# Altium schematic sheet ESP01_Relay.SchDoc
size A4; SheetNumber: 1; SheetTotal: 1
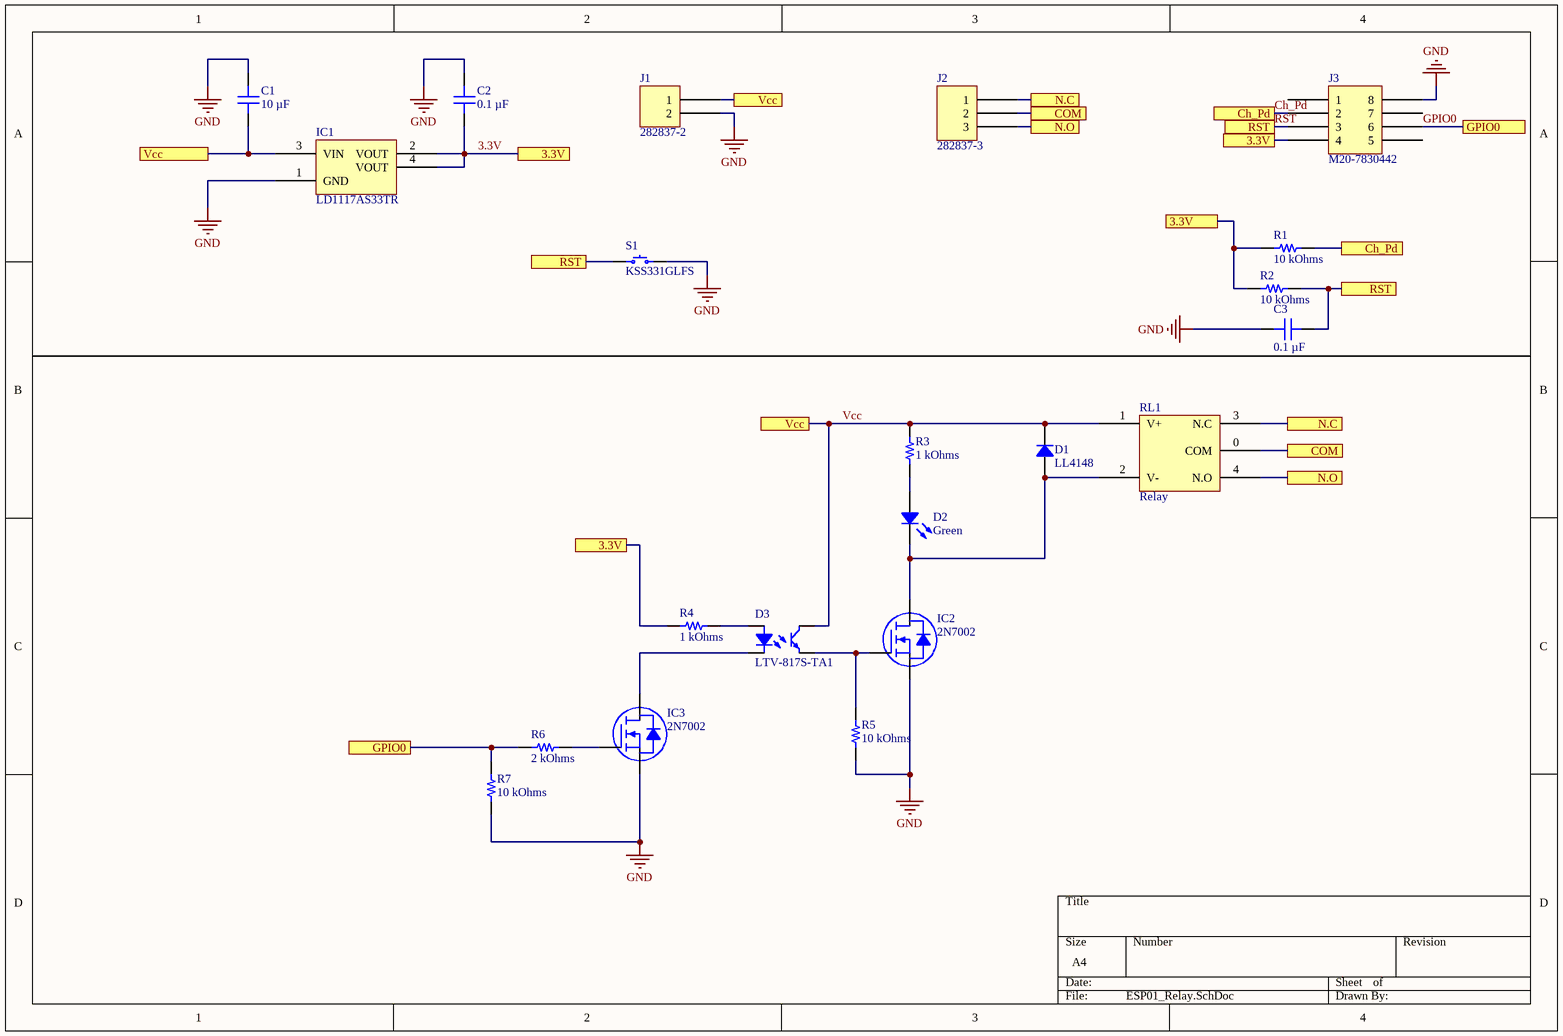
[diagram p0: ESP01_Relay.SchDoc]

## Parts
C1  10 µF  [CAP 1206_3216 - 0.8MM]
C2  0.1 µF  [CAP 1206_3216 - 0.8MM]
C3  0.1 µF  [CAP 0805_2012]
D1  LL4148  [SOD-80 MiniMELF]
D2  Green  [LED 1206_3216 GREEN]
D3  LTV-817S-TA1  [LITEON LTV-817]
IC1  LD1117AS33TR  [ST SOT-223]
IC2  2N7002  [ON SEMI SOT-23-3]
IC3  2N7002  [ON SEMI SOT-23-3]
J1  282837-2  [TE 282837-2]
J2  282837-3  [TE 282837-3]
J3  M20-7830442  [HARWIN M20-7830445]
R1  10 kOhms  [RES 1206_3216]
R2  10 kOhms  [RES 1206_3216]
R3  1 kOhms  [RES 1206_3216]
R4  1 kOhms  [RES 1206_3216]
R5  10 kOhms  [RES 1206_3216]
R6  2 kOhms  [RES 1206_3216]
R7  10 kOhms  [RES 1206_3216]
RL1  Relay  [Relay]
S1  KSS331GLFS  [C&K KSS]

## Ports
3.3V (see ESP01_Relay[2A], ESP01_Relay[2C], ESP01_Relay[3A]), 3.3V (see ESP01_Relay[2A], ESP01_Relay[2C], ESP01_Relay[4A]), 3.3V (see ESP01_Relay[2A], ESP01_Relay[3A], ESP01_Relay[4A]), 3.3V (see ESP01_Relay[2C], ESP01_Relay[3A], ESP01_Relay[4A]), Ch_Pd (see ESP01_Relay[4A]), COM (see ESP01_Relay[3A]), COM (see ESP01_Relay[4B]), GPIO0 (see ESP01_Relay[1C]), GPIO0 (see ESP01_Relay[4A]), N.C (see ESP01_Relay[3A]), N.C (see ESP01_Relay[4B]), N.O (see ESP01_Relay[3A]), N.O (see ESP01_Relay[4B]), RST (see ESP01_Relay[2B], ESP01_Relay[4A]), RST (see ESP01_Relay[2B], ESP01_Relay[4B]), RST (see ESP01_Relay[4A], ESP01_Relay[4B]), Vcc (see ESP01_Relay[1A], ESP01_Relay[2A]), Vcc (see ESP01_Relay[1A], ESP01_Relay[2B]), Vcc (see ESP01_Relay[2A], ESP01_Relay[2B])

## Nets
GND: C1.1 C2.1 C3.1 IC1.1(GND) IC2.2(S) IC3.2(S) J1.2 J3.8 R5.1 R7.1 S1.2
3.3V: C2.2 IC1.2(VOUT) IC1.4(VOUT) J3.4 R1.1 R2.1 R4.2 ; port 3.3V
Ch_Pd: J3.2 R1.2 ; port Ch_Pd
COM: J2.2 RL1.0(COM) ; port COM
GPIO0: J3.6 R6.1 R7.2 ; port GPIO0
N.C: J2.1 RL1.3(N.C) ; port N.C
N.O: J2.3 RL1.4(N.O) ; port N.O
RST: C3.2 J3.3 R2.2 S1.1 ; port RST
Vcc: C1.2 D1.2 D3.4 IC1.3(VIN) J1.1 R3.2 RL1.1(V+) ; port Vcc
NetD1_1: D1.1 D2.2 IC2.3(D) RL1.2(V-)
NetD2_1: D2.1 R3.1
NetD3_1: D3.1 R4.1
NetD3_2: D3.2 IC3.3(D)
NetD3_3: D3.3 IC2.1(G) R5.2
NetIC3_1: IC3.1(G) R6.2

Not connected (* = marked no-connect by the designer): J3 1 5 7

## Library data of the parts
C1 = 1206B106K160CT: CAP CER 10UF 16V X7R 1206; manufacturer: Walsin Technology Corporation; Tolerance: ±10%; Part Number: 1206B106K160CT; Value: 10 µF; Applications: General Purpose; Capacitance: 10 µF; componentlink1description: Datasheet; componentlink1url: https://www.passivecomponent.com/wp-content/uploads/datasheet/WTC_MLCC_General_Purpose.pdf; componentlink2description: DigiKey Link; componentlink2url: https://www.digikey.com/en/products/detail/walsin-technology-corporation/1206B106K160CT/6707562; Device Package: 1206 (3216 Metric); lastupdated: 23.10.2023 19:16:40; Lifecycle Status: Active; Minimum Order: 2000; Mounting Type: Surface Mount, MLCC; Operating Temperature: -55°C ~ 125°C; Package / Case: 1206 (3216 Metric); packaging: TapeAndReel; partid: 49918; Part Status: Active; price: 0.20; series: -; Size / Dimension: 0.126" L x 0.063" W (3.20mm x 1.60mm); Supplier 1: DigiKey; Supplier Part Number 1: 1206B106K160CT-ND; Temperature Coefficient: X7R; Thickness (Max): 0.075" (1.90mm); Voltage - Rated: 16V
C2 = 1206B104J500CT: CAP CER 0.1UF 50V X7R 1206; manufacturer: Walsin Technology Corporation; Tolerance: ±5%; Part Number: 1206B104J500CT; Value: 0.1 µF; Applications: General Purpose; Capacitance: 0.1 µF; componentlink1description: Datasheet; componentlink1url: http://www.passivecomponent.com/wp-content/uploads/2018/10/MLCC.pdf; componentlink2description: DigiKey Link; componentlink2url: https://www.digikey.com/en/products/detail/walsin-technology-corporation/1206B104J500CT/9355099; Device Package: 1206 (3216 Metric); lastupdated: 23.10.2023 19:17:26; Lifecycle Status: Active; Minimum Order: 1; Mounting Type: Surface Mount, MLCC; Operating Temperature: -55°C ~ 125°C; Package / Case: 1206 (3216 Metric); packaging: TapeAndReel; partid: 19711; Part Status: Active; price: 0.02; series: -; Size / Dimension: 0.126" L x 0.063" W (3.20mm x 1.60mm); Supplier 1: DigiKey; Supplier Part Number 1: 1292-1602-1-ND; Temperature Coefficient: X7R; Thickness (Max): 0.035" (0.90mm); Voltage - Rated: 50V
C3 = CC0805MRX7R9BB104: CAP CER 0.1UF 50V X7R 0805; manufacturer: Yageo; Tolerance: ±20%; Part Number: CC0805MRX7R9BB104; Value: 0.1 µF; Applications: General Purpose; Capacitance: 0.1 µF; componentlink1description: Datasheet; componentlink1url: https://www.yageo.com/upload/media/product/productsearch/datasheet/mlcc/UPY-GPHC_X7R_6.3V-to-50V_18.pdf; componentlink2description: DigiKey Link; componentlink2url: https://www.digikey.com/en/products/detail/yageo/CC0805MRX7R9BB104/5884281; Device Package: 0805 (2012 Metric); lastupdated: 24.10.2023 19:16:25; Lifecycle Status: Active; Minimum Order: 1; Mounting Type: Surface Mount, MLCC; Operating Temperature: -55°C ~ 125°C; Package / Case: 0805 (2012 Metric); packaging: TapeAndReel; partid: 2475; Part Status: Active; price: 0.01; series: CC; Size / Dimension: 0.079" L x 0.049" W (2.00mm x 1.25mm); Supplier 1: DigiKey; Supplier Part Number 1: 311-4351-1-ND; Temperature Coefficient: X7R; Thickness (Max): 0.037" (0.95mm); Voltage - Rated: 50V
D1 = LL4148: DIODE GEN PURP 100V 200MA SOD80; Manufacturer: ON Semiconductor; Current - Reverse Leakage @ Vr: 25nA @ 20V; Diode Type: Standard; Reverse Recovery Time (trr): 4ns; Speed: Small Signal =< 200mA (Io), Any Speed; Voltage - Forward (Vf) (Max) @ If: 1V @ 10mA; Part Number: LL4148; ComponentLink1Description: Datasheet; ComponentLink1URL: https://www.onsemi.com/pub/Collateral/LL4148-D.pdf; ComponentLink2Description: DigiKey Link; ComponentLink2URL: http://digikey.com/product-detail/en/on-semiconductor/LL4148/LL4148FSCT-ND/1923118; Current - Average Rectified (Io): 200mA; LastUpdated: 23.10.2023 20:25:50; Lifecycle Status: Active; Minimum Order: 1; Mounting Type: Surface Mount; Operating Temperature - Junction: -55°C ~ 175°C; Package / Case: DO-213AC, MINI-MELF, SOD-80; Packaging: TapeAndReel; PartId: 2621; Part Status: Active; Price: 0.02; Series: -; Supplier 1: DigiKey; Supplier Part Number 1: LL4148FSCT-ND; Supplier Device Package: SOD-80; Voltage - DC Reverse (Vr) (Max): 100V
D2 = XZVG55W-A2: LED GREEN CLEAR 2SMD; Manufacturer: SunLED; Configuration: Standard; Current - Test: 20mA; Lens Color: Colorless; Lens Size: 1.60mm Dia; Lens Style: Round with Flat Top; Millicandela Rating: 98mcd; Viewing Angle: 70°; Voltage - Forward (Vf) (Typ): 2.1V; Wavelength - Dominant: 570nm; Wavelength - Peak: 574nm; Part Number: XZVG55W-A2; Color: Green; ComponentLink1Description: Datasheet; ComponentLink1URL: https://www.sunledusa.com/products/spec/XZVG55W-A2.pdf; ComponentLink2Description: DigiKey Link; ComponentLink2URL: https://www.digikey.com/en/products/detail/sunled/XZVG55W-A2/4902120; Device Package: 1206 (3216 Metric); Height (Max): 1.10mm; LastUpdated: 23.10.2023 20:20:25; Lens Transparency: Clear; Lifecycle Status: Active; Minimum Order: 1; Mounting Type: Surface Mount; Package / Case: 1206 (3216 Metric); Packaging: TapeAndReel; PartId: 523; Part Status: Active; Price: 0.07; Series: -; Size / Dimension: 3.20mm L x 1.60mm W; Supplier 1: DigiKey; Supplier Part Number 1: 1497-1403-1-ND; Supplier Device Package: 2-SMD; Value: Green
D3 = LTV-817S-TA1: OPTOISOLATR 5KV TRANSISTOR 4-SMD; Manufacturer: Lite-On Inc.; Current - DC Forward (If) (Max): 50mA; Current Transfer Ratio (Max): 600% @ 5mA; Current Transfer Ratio (Min): 50% @ 5mA; Input Type: DC; Number of Channels: 1; Rise / Fall Time (Typ): 4µs, 3µs; Vce Saturation (Max): 200mV; Voltage - Forward (Vf) (Typ): 1.2V; Voltage - Isolation: 5000Vrms; Voltage - Output (Max): 35V; Part Number: LTV-817S-TA1; ComponentLink1Description: Datasheet; ComponentLink1URL: http://optoelectronics.liteon.com/upload/download/DS-70-96-0016/LTV-8X7%20series%20201610%20.pdf; ComponentLink2Description: DigiKey Link; ComponentLink2URL: http://digikey.com/product-detail/en/lite-on-inc/LTV-817S-TA1/160-1893-1-ND/3306757; Current - Output / Channel: 50mA; Device Package: 4-SMD, Gull Wing; LastUpdated: 12.01.2020 21:58:48; Lifecycle Status: Active; Minimum Order: 1; Mounting Type: Surface Mount; Operating Temperature: -30°C ~ 110°C; Output Type: Transistor; Package / Case: 4-SMD, Gull Wing; Packaging: TapeAndReel; Part Status: Active; Price: 0.12; Series: -; Supplier 1: DigiKey; Supplier Part Number 1: 160-1893-1-ND; Supplier Device Package: 4-SMD
IC1 = LD1117AS33TR: IC REG LINEAR 3.3V 1A SOT223; Manufacturer: STMicroelectronics; Current - Quiescent (Iq): 10 mA; Number of Regulators: 1; Output Configuration: Positive; Output Type: Fixed; Protection Features: Over Current, Over Temperature; PSRR: 75dB (120Hz); Voltage Dropout (Max): 1.3V @ 1A; Voltage - Input (Max): 15V; Part Number: LD1117AS33TR; ComponentLink1Description: Datasheet; ComponentLink1URL: http://www.st.com/content/ccc/resource/technical/document/datasheet/a5/c3/3f/c9/2b/15/40/49/CD00002116.pdf/files/CD00002116.pdf/jcr:content/translations/en.CD00002116.pdf; ComponentLink2Description: DigiKey Link; ComponentLink2URL: https://www.digikey.com/en/products/detail/stmicroelectronics/LD1117AS33TR/585752; Current - Output: 1A; LastUpdated: 23.10.2023 20:33:15; Lifecycle Status: Active; Minimum Order: 1; Mounting Type: Surface Mount; Operating Temperature: 0°C ~ 125°C; Package / Case: TO-261-4, TO-261AA; Packaging: TapeAndReel; Part Status: Active; Price: 0.37; Series: -; Supplier 1: DigiKey; Supplier Part Number 1: 497-1228-1-ND; Supplier Device Package: SOT-223; Voltage - Output (Min/Fixed): 3.3V
IC2 IC3 = 2N7002: MOSFET N-CH 60V 115MA SOT-23; Manufacturer: ON Semiconductor; Current - Continuous Drain (Id) @ 25°C: 115mA (Ta); Drive Voltage (Max Rds On,  Min Rds On): 5V, 10V; FET Type: N-Channel; Input Capacitance (Ciss) (Max) @ Vds: 50pF @ 25V; Power Dissipation (Max): 200mW (Ta); Rds On (Max) @ Id, Vgs: 7.5Ohm @ 500mA, 10V; Vgs (Max): ±20V; Vgs(th) (Max) @ Id: 2.5V @ 250µA; Part Number: 2N7002; ComponentLink1Description: Datasheet; ComponentLink1URL: https://www.onsemi.com/pub/Collateral/NDS7002A-D.PDF; ComponentLink2Description: DigiKey Link; ComponentLink2URL: http://digikey.com/product-detail/en/on-semiconductor/2N7002/2N7002NCT-ND/244664; Drain to Source Voltage (Vdss): 60V; LastUpdated: 23.10.2023 20:34:06; Lifecycle Status: Active; Minimum Order: 1; Mounting Type: Surface Mount; Operating Temperature: -55°C ~ 150°C (TJ); Package / Case: TO-236-3, SC-59, SOT-23-3; Packaging: TapeAndReel; Part Status: Active; Price: 0.06; Series: -; Supplier 1: DigiKey; Supplier Part Number 1: 2N7002NCT-ND; Supplier Device Package: SOT-23 (TO-236AB); Technology: MOSFET (Metal Oxide)
J1 = 282837-2: TERM BLK 2P SIDE ENT 5.08MM PCB; Manufacturer: TE Connectivity AMP Connectors; Current: 13.5 A; Mating Orientation: Horizontal with Board; Number of Levels: 1; Pitch: 0.200" (5.08mm); Positions Per Level: 2; Voltage: 300 V; Wire Gauge: 16-28 AWG; Wire Termination: Screw - Rising Cage Clamp; Part Number: 282837-2; Color: Green; ComponentLink1Description: Datasheet; ComponentLink1URL: https://www.te.com/commerce/DocumentDelivery/DDEController?Action=srchrtrv&DocNm=282837&DocType=Customer+Drawing&DocLang=English; ComponentLink2Description: DigiKey Link; ComponentLink2URL: https://www.digikey.com/en/products/detail/te-connectivity-amp-connectors/282837-2/2187973; Features: Interlocking (Side); LastUpdated: 21.06.2022 15:00:23; Lifecycle Status: Active; Minimum Order: 1; Mounting Type: Through Hole; Packaging: Tray; Part Status: Active; Price: 0.31; Series: Buchanan; Supplier 1: DigiKey; Supplier Part Number 1: A113320-ND
J2 = 282837-3: TERM BLK 3P SIDE ENT 5.08MM PCB; Manufacturer: TE Connectivity AMP Connectors; Current: 13.5 A; Mating Orientation: Horizontal with Board; Number of Levels: 1; Pitch: 0.200" (5.08mm); Positions Per Level: 3; Voltage: 300 V; Wire Gauge: 16-28 AWG; Wire Termination: Screw - Rising Cage Clamp; Part Number: 282837-3; Color: Green; ComponentLink1Description: Datasheet; ComponentLink1URL: https://www.te.com/commerce/DocumentDelivery/DDEController?Action=srchrtrv&DocNm=282837&DocType=Customer+Drawing&DocLang=English; ComponentLink2Description: DigiKey Link; ComponentLink2URL: https://www.digikey.com/en/products/detail/te-connectivity-amp-connectors/282837-3/2187974; Features: Interlocking (Side); LastUpdated: 21.06.2022 15:00:39; Lifecycle Status: Active; Minimum Order: 1; Mounting Type: Through Hole; Packaging: Tray; Part Status: Active; Price: 0.47; Series: Buchanan; Supplier 1: DigiKey; Supplier Part Number 1: A113321-ND
J3 = M20-7830442: CONN RCPT 8POS 0.1 GOLD PCB; Manufacturer: Harwin Inc.; Connector Type: Receptacle; Contact Length - Post: 0.118" (3.00mm); Current Rating (Amps): 3A; Mated Stacking Heights: 11.04mm, 12.63mm; Material Flammability Rating: UL94 V-0; Number of Positions: 8; Number of Positions Loaded: All; Pitch - Mating: 0.100" (2.54mm); Style: Board to Board or Cable; Part Number: M20-7830442; ComponentLink1Description: Datasheet; ComponentLink1URL: https://cdn.harwin.com/pdfs/C001XX_M20_Series_Connectors.pdf; ComponentLink2Description: DigiKey Link; ComponentLink2URL: http://digikey.com/product-detail/en/harwin-inc/M20-7830442/952-1789-ND/3727758; Contact Finish - Mating: Gold; Contact Finish - Post: Tin; Contact Finish Thickness - Mating: Flash; Contact Type: Female Socket; Fastening Type: Push-Pull; Insulation Color: Black; Insulation Height: 0.335" (8.51mm); LastUpdated: 21.09.2022 19:04:26; Lifecycle Status: Active; Minimum Order: 1; Mounting Type: Through Hole; Number of Rows: 2; Operating Temperature: -40°C ~ 105°C; Packaging: Tube; Part Status: Active; Price: 1.36; Row Spacing - Mating: 0.100" (2.54mm); Series: M20; Supplier 1: DigiKey; Supplier Part Number 1: 952-1789-ND; Termination: Solder
R1 R2 R5 R7 = CRGCQ1206F10K: RES 10K OHM 1% 1/4W 1206; Manufacturer: TE Connectivity Passive Product; Power (Watts): 0.25W, 1/4W; Temperature Coefficient: ±100ppm/°C; Part Number: CRGCQ1206F10K; ComponentLink1Description: Datasheet; ComponentLink1URL: https://www.te.com/commerce/DocumentDelivery/DDEController?Action=srchrtrv&DocNm=1773204-3&DocType=DS&DocLang=English; ComponentLink2Description: DigiKey Link; ComponentLink2URL: https://www.digikey.com/en/products/detail/te-connectivity-passive-product/CRGCQ1206F10K/8576424; Composition: Thick Film; Device Package: 1206 (3216 Metric); Features: Automotive AEC-Q200, Moisture Resistant; Height - Seated (Max): 0.026" (0.65mm); LastUpdated: 23.10.2023 19:45:32; Lifecycle Status: Active; Minimum Order: 1; Number of Terminations: 2; Operating Temperature: -55°C ~ 155°C; Package / Case: 1206 (3216 Metric); Packaging: TapeAndReel; PartId: 27005; Part Status: Active; Price: 0.01; Ratings: AEC-Q200; Resistance: 10 kOhms; Series: CRGCQ; Size / Dimension: 0.122" L x 0.061" W (3.10mm x 1.55mm); Supplier 1: DigiKey; Supplier Part Number 1: A129822CT-ND; Supplier Device Package: 1206; Tolerance: ±1%; Value: 10 kOhms
R3 R4 = KTR18EZPJ102: RES SMD 1K OHM 5% 1/4W 1206; Manufacturer: Rohm Semiconductor; Power (Watts): 0.25W, 1/4W; Temperature Coefficient: ±200ppm/°C; Part Number: KTR18EZPJ102; ComponentLink1Description: Datasheet; ComponentLink1URL: https://www.rohm.com/datasheet/KTR03EZPF/ktr-e; ComponentLink2Description: DigiKey Link; ComponentLink2URL: https://www.digikey.com/en/products/detail/rohm-semiconductor/KTR18EZPJ102/1763425; Composition: Thick Film; Device Package: 1206 (3216 Metric); Features: Automotive AEC-Q200, High Voltage; Height - Seated (Max): 0.026" (0.65mm); LastUpdated: 23.10.2023 19:45:33; Lifecycle Status: Active; Minimum Order: 1; Number of Terminations: 2; Operating Temperature: -55°C ~ 155°C; Package / Case: 1206 (3216 Metric); Packaging: TapeAndReel; PartId: 26955; Part Status: Active; Price: 0.02; Ratings: AEC-Q200; Resistance: 1 kOhms; Series: KTR; Size / Dimension: 0.126" L x 0.063" W (3.20mm x 1.60mm); Supplier 1: DigiKey; Supplier Part Number 1: RHM1.0KPCT-ND; Supplier Device Package: 1206; Tolerance: ±5%; Value: 1 kOhms
R6 = AC1206JR-072KL: RES SMD 2K OHM 5% 1/4W 1206; Manufacturer: Yageo; Power (Watts): 0.25W, 1/4W; Temperature Coefficient: ±100ppm/°C; Part Number: AC1206JR-072KL; ComponentLink1Description: Datasheet; ComponentLink1URL: https://www.yageo.com/upload/media/product/productsearch/datasheet/rchip/PYu-AC_51_RoHS_L_7.pdf; ComponentLink2Description: DigiKey Link; ComponentLink2URL: https://www.digikey.com/en/products/detail/yageo/AC1206JR-072KL/5897821; Composition: Thick Film; Device Package: 1206 (3216 Metric); Features: Automotive AEC-Q200, Moisture Resistant; Height - Seated (Max): 0.026" (0.65mm); LastUpdated: 23.10.2023 19:45:31; Lifecycle Status: Active; Minimum Order: 1; Number of Terminations: 2; Operating Temperature: -55°C ~ 155°C; Package / Case: 1206 (3216 Metric); Packaging: TapeAndReel; PartId: 27112; Part Status: Active; Price: 0.01; Ratings: AEC-Q200; Resistance: 2 kOhms; Series: AC; Size / Dimension: 0.122" L x 0.063" W (3.10mm x 1.60mm); Supplier 1: DigiKey; Supplier Part Number 1: YAG3946CT-ND; Supplier Device Package: 1206; Tolerance: ±5%; Value: 2 kOhms
RL1 = Relay: Relay 5v 5 pin
S1 = KSS331GLFS: SWITCH TACTILE SPST-NO 0.05A 50V; Manufacturer: C&K; Actuator Orientation: Side Actuated; Actuator Type: Rectangular Button; Contact Rating @ Voltage: 0.05A @ 50VDC; Illumination: Non-Illuminated; Ingress Protection: IP40; Operating Force: 250gf; Outline: 7.60mm x 3.70mm; Switch Function: Off-Mom; Part Number: KSS331GLFS; Circuit: SPST-NO; ComponentLink1Description: Datasheet; ComponentLink1URL: https://dznh3ojzb2azq.cloudfront.net/products/Tactile/KSS/documents/datasheet.pdf; ComponentLink2Description: DigiKey Link; ComponentLink2URL: http://digikey.com/product-detail/en/c-k/KSS331GLFS/401-1101-1-ND/417673; Features: Tactile Feedback; LastUpdated: 9.04.2020 09:55:46; Lifecycle Status: Active; Minimum Order: 1; Mounting Type: Surface Mount, Right Angle; Operating Temperature: -40°C ~ 85°C; Packaging: TapeAndReel; Part Status: Active; Price: 0.35; Series: KSS; Supplier 1: DigiKey; Supplier Part Number 1: 401-1101-1-ND; Termination Style: Gull Wing